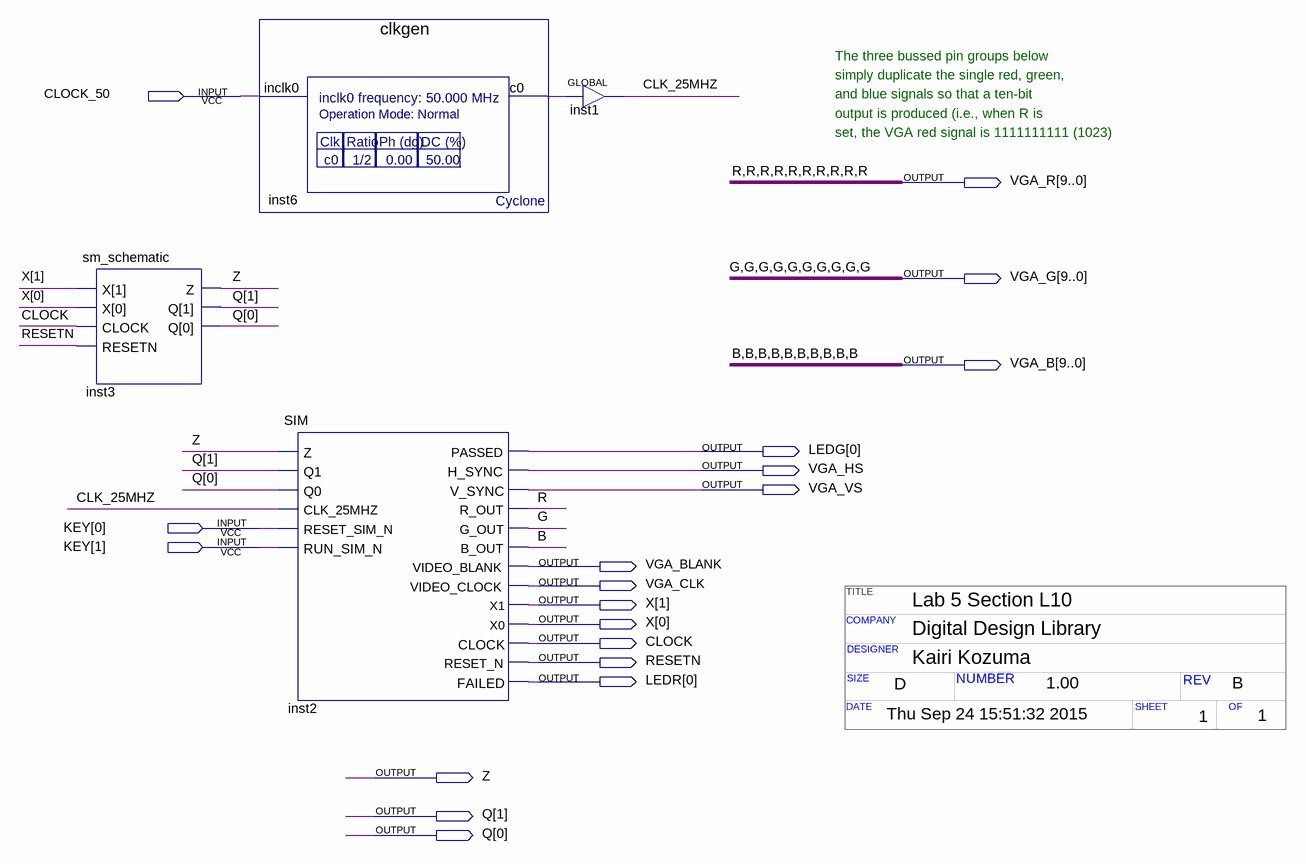
[diagram p0: schematic sheet]
// Quartus schematic SM_TESTER.bdf as structural Verilog: 4 symbols, 19 pins
// Title block: TITLE: Lab 5 Section L10; COMPANY: Digital Design Library; DESIGNER: Kairi Kozuma; SIZE: D; NUMBER: 1.00; REV: B; DATE: Thu Sep 24 15:51:32 2015; SHEET: 1; OF: 1
module SM_TESTER (
  input  CLOCK_50,
  input  [1:0] KEY,
  output [9:0] VGA_R,
  output [9:0] VGA_G,
  output [9:0] VGA_B,
  output [0:0] LEDG,
  output VGA_HS,
  output VGA_VS,
  output VGA_BLANK,
  output VGA_CLK,
  output [1:0] X,
  output CLOCK,
  output RESETN,
  output [0:0] LEDR,
  output Z,
  output [1:0] Q
);

  wire CLK_25MHZ, inst6_c0;

  sm_schematic inst3 (.X(X), .CLOCK(CLOCK), .RESETN(RESETN), .Z(Z), .Q(Q));
  clkgen inst6 (.inclk0(CLOCK_50), .c0(inst6_c0));
  SIM inst2 (
    .Z(Z), .Q1(Q[1]), .Q0(Q[0]), .CLK_25MHZ(CLK_25MHZ), .RESET_SIM_N(KEY[0]), .RUN_SIM_N(KEY[1]),
    .PASSED(LEDG[0]), .H_SYNC(VGA_HS), .V_SYNC(VGA_VS), .R_OUT(VGA_R[9]), .G_OUT(VGA_G[9]), .B_OUT(VGA_B[9]),
    .VIDEO_BLANK(VGA_BLANK), .VIDEO_CLOCK(VGA_CLK), .X1(X[1]), .X0(X[0]), .CLOCK(CLOCK), .RESET_N(RESETN),
    .FAILED(LEDR[0]));
  GLOBAL inst1 (.IN(inst6_c0), .OUT(CLK_25MHZ));

  assign VGA_B[8:0] = {9{VGA_B[9]}};
  assign VGA_G[8:0] = {9{VGA_G[9]}};
  assign VGA_R[8:0] = {9{VGA_R[9]}};

  // Other names for the same wires on the sheet: B = VGA_B[9]; G = VGA_G[9]; R = VGA_R[9]

  // Notes on the sheet:
  //   The three bussed pin groups below
  //   simply duplicate the single red, green,
  //   and blue signals so that a ten-bit
  //   output is produced (i.e., when R is
  //   set, the VGA red signal is 1111111111 (1023)
endmodule
